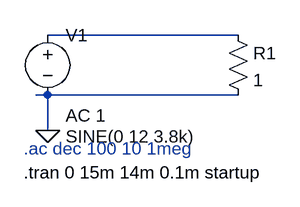
[diagram p0: schematic Senoidal_Ideal.asc]
Senoidal_Ideal.asc, the LTspice schematic file:
Version 4.1
SHEET 1 880 680
WIRE 272 80 16 80
WIRE 16 160 0 160
WIRE 272 160 16 160
WIRE 16 208 16 160
FLAG 16 208 0
SYMBOL voltage 16 64 R0
WINDOW 3 24 152 Left 2
WINDOW 123 24 124 Left 2
WINDOW 39 0 0 Left 0
SYMATTR Value SINE(0 12 3.8k)
SYMATTR Value2 AC 1
SYMATTR InstName V1
SYMBOL res 256 64 R0
SYMATTR InstName R1
SYMATTR Value 1
TEXT -16 232 Left 2 ;.ac dec 100 10 1meg
TEXT -16 264 Left 2 !.tran 0 15m 14m 0.1m startup

The netlist it stands for:
* Senoidal_Ideal.asc
V1 N001 0 SINE(0 12 3.8k) AC 1
R1 N001 0 1
* .ac dec 100 10 1meg
.tran 0 15m 14m 0.1m startup
.backanno
.end